# Altium schematic sheet MAIN.SchDoc
size A3; ApprovedBy: Mustafa Atılay Beycan; CheckedBy: Mustafa Atılay Beycan; Author: Mustafa Atılay Beycan; CompanyName: Mustafa Atılay Beycan; DrawnBy: Mustafa Atılay Beycan; Engineer: Mustafa Atılay Beycan; Organization: Mustafa Atılay Beycan; SheetNumber: 2; SheetTotal: 8; FilePath: https://github.com/mustafaatilay/Outdoor-Tracking-Project
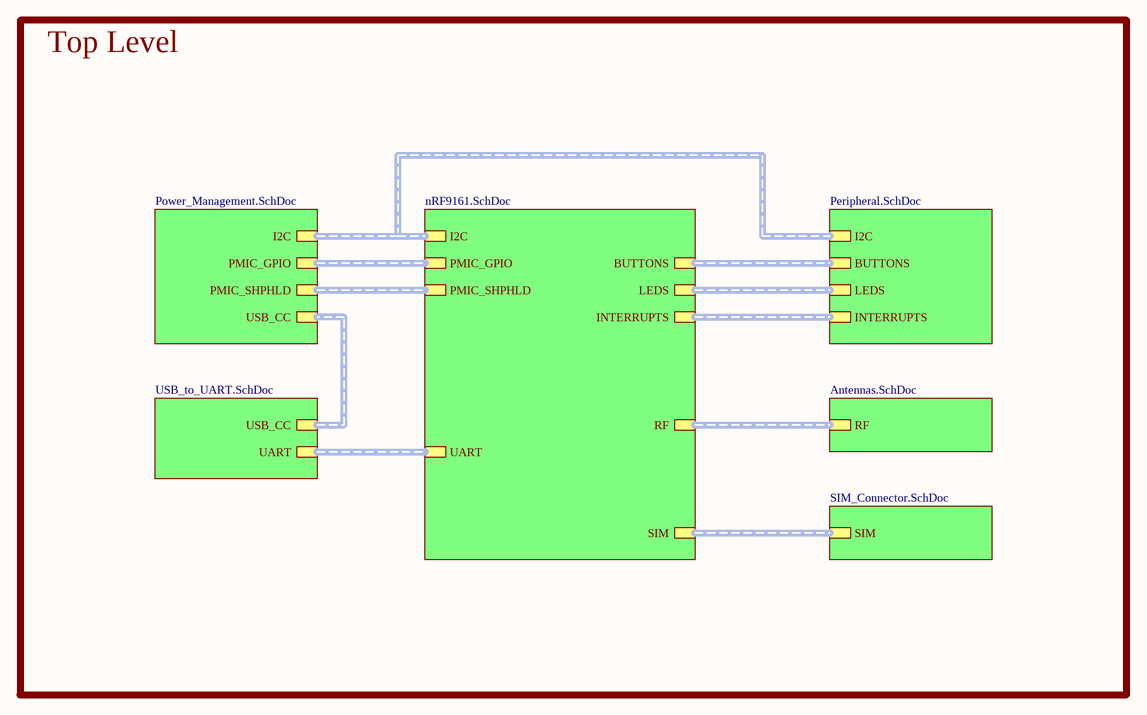
[diagram p0: MAIN.SchDoc]

## Sub-sheets
U_Antennas = Antennas.SchDoc: RF (harness RF)
U_nRF9161 = nRF9161.SchDoc: I2C (harness I2C), BUTTONS (harness BUTTONS), LEDS (harness LEDS), INTERRUPTS (harness INTERRUPTS), SIM (harness SIM), RF (harness RF), UART (harness UART), PMIC_GPIO (harness PMIC_GPIO), PMIC_SHPHLD (harness PMIC_SHPHLD)
U_Peripheral = Peripheral.SchDoc: I2C (harness I2C), BUTTONS (harness BUTTONS), LEDS (harness LEDS), INTERRUPTS (harness INTERRUPTS)
U_Power_Management = Power_Management.SchDoc: I2C (harness I2C), PMIC_GPIO (harness PMIC_GPIO), USB_CC (harness USB_CC), PMIC_SHPHLD (harness PMIC_SHPHLD)
U_SIM_Connector = SIM_Connector.SchDoc: SIM (harness SIM)
U_USB_to_UART = USB_to_UART.SchDoc: UART (harness UART), USB_CC (harness USB_CC)

## Buses and harness runs
harness sheet U_Antennas/RF = sheet U_nRF9161/RF
harness sheet U_nRF9161/BUTTONS = sheet U_Peripheral/BUTTONS
harness sheet U_nRF9161/I2C = sheet U_Peripheral/I2C = sheet U_Power_Management/I2C
harness sheet U_nRF9161/INTERRUPTS = sheet U_Peripheral/INTERRUPTS
harness sheet U_nRF9161/LEDS = sheet U_Peripheral/LEDS
harness sheet U_nRF9161/PMIC_GPIO = sheet U_Power_Management/PMIC_GPIO
harness sheet U_nRF9161/PMIC_SHPHLD = sheet U_Power_Management/PMIC_SHPHLD
harness sheet U_nRF9161/SIM = sheet U_SIM_Connector/SIM
harness sheet U_nRF9161/UART = sheet U_USB_to_UART/UART
harness sheet U_Power_Management/USB_CC = sheet U_USB_to_UART/USB_CC

## Notes on the sheet
- Top Level
- Project Name
- Designed by
- Schematic Name
- Checked by
- Page Size
- File Path
- Modified Date
- Revision No
- Sheet
- of
- A3